# Altium schematic sheet 0_SurvBot_RCU_Overview.SchDoc
size A4; SheetNumber: 1; SheetTotal: 8
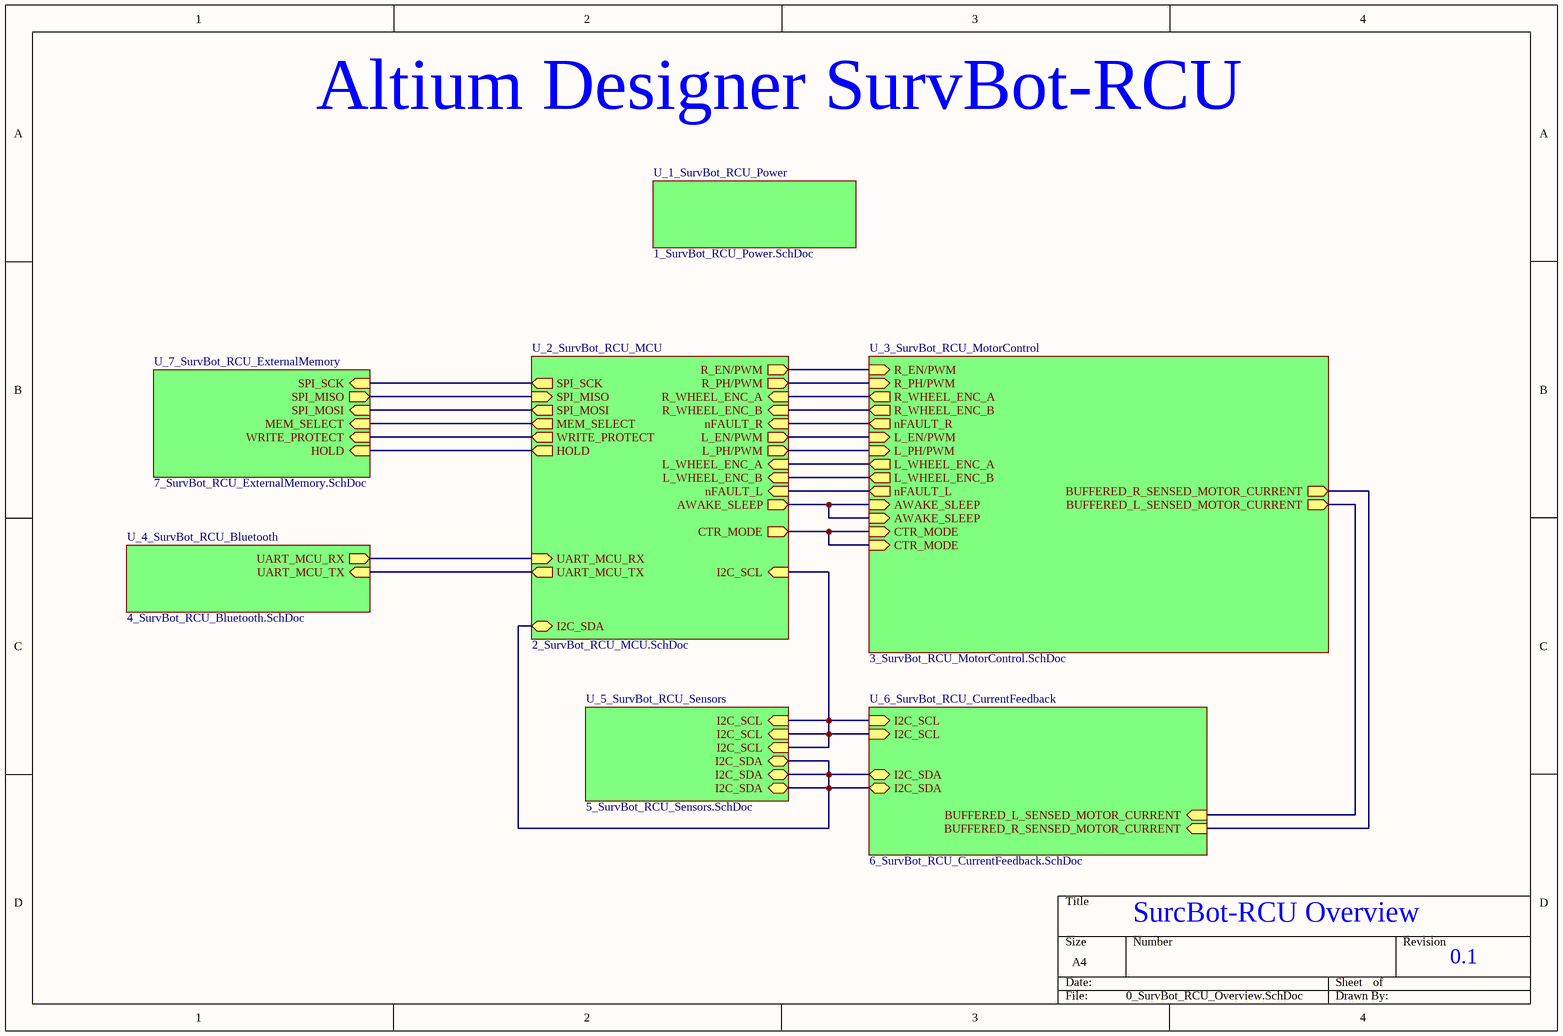
[diagram p0: 0_SurvBot_RCU_Overview.SchDoc]

## Sub-sheets
U_1_SurvBot_RCU_Power = 1_SurvBot_RCU_Power.SchDoc: no entries
U_2_SurvBot_RCU_MCU = 2_SurvBot_RCU_MCU.SchDoc: R_PH/PWM (out), R_EN/PWM (out), L_WHEEL_ENC_A (in), L_WHEEL_ENC_B (in), L_PH/PWM (out), L_EN/PWM (out), MEM_SELECT (out), SPI_MOSI (out), SPI_MISO (in), SPI_SCK (out), WRITE_PROTECT (out), HOLD (out), nFAULT_L (in), nFAULT_R (in), UART_MCU_TX (out), UART_MCU_RX (in), CTR_MODE (out), AWAKE_SLEEP (out), R_WHEEL_ENC_A (in), R_WHEEL_ENC_B (in), I2C_SDA (bidir), I2C_SCL (in)
U_3_SurvBot_RCU_MotorControl = 3_SurvBot_RCU_MotorControl.SchDoc: R_EN/PWM (in), R_PH/PWM (in), CTR_MODE (in), nFAULT_R (out), BUFFERED_R_SENSED_MOTOR_CURRENT (out), BUFFERED_L_SENSED_MOTOR_CURRENT (out), R_WHEEL_ENC_A (out), R_WHEEL_ENC_B (out), L_WHEEL_ENC_A (out), L_WHEEL_ENC_B (out), AWAKE_SLEEP (in), L_EN/PWM (in), L_PH/PWM (in), nFAULT_L (out), AWAKE_SLEEP (in), CTR_MODE (in)
U_4_SurvBot_RCU_Bluetooth = 4_SurvBot_RCU_Bluetooth.SchDoc: UART_MCU_TX (in), UART_MCU_RX (out)
U_5_SurvBot_RCU_Sensors = 5_SurvBot_RCU_Sensors.SchDoc: I2C_SDA (bidir), I2C_SCL (in), I2C_SDA (bidir), I2C_SCL (in), I2C_SDA (bidir), I2C_SCL (in)
U_6_SurvBot_RCU_CurrentFeedback = 6_SurvBot_RCU_CurrentFeedback.SchDoc: I2C_SCL (in), I2C_SDA (bidir), BUFFERED_R_SENSED_MOTOR_CURRENT (in), I2C_SCL (in), I2C_SDA (bidir), BUFFERED_L_SENSED_MOTOR_CURRENT (in)
U_7_SurvBot_RCU_ExternalMemory = 7_SurvBot_RCU_ExternalMemory.SchDoc: MEM_SELECT (in), SPI_MOSI (in), SPI_MISO (out), SPI_SCK (in), WRITE_PROTECT (in), HOLD (in)

## Nets
(unnamed): sheet U_2_SurvBot_RCU_MCU/R_PH/PWM, sheet U_3_SurvBot_RCU_MotorControl/R_PH/PWM
(unnamed): sheet U_2_SurvBot_RCU_MCU/R_EN/PWM, sheet U_3_SurvBot_RCU_MotorControl/R_EN/PWM
(unnamed): sheet U_2_SurvBot_RCU_MCU/L_WHEEL_ENC_A, sheet U_3_SurvBot_RCU_MotorControl/L_WHEEL_ENC_A
(unnamed): sheet U_2_SurvBot_RCU_MCU/L_WHEEL_ENC_B, sheet U_3_SurvBot_RCU_MotorControl/L_WHEEL_ENC_B
(unnamed): sheet U_2_SurvBot_RCU_MCU/L_PH/PWM, sheet U_3_SurvBot_RCU_MotorControl/L_PH/PWM
(unnamed): sheet U_2_SurvBot_RCU_MCU/L_EN/PWM, sheet U_3_SurvBot_RCU_MotorControl/L_EN/PWM
(unnamed): sheet U_2_SurvBot_RCU_MCU/MEM_SELECT, sheet U_7_SurvBot_RCU_ExternalMemory/MEM_SELECT
(unnamed): sheet U_2_SurvBot_RCU_MCU/SPI_MOSI, sheet U_7_SurvBot_RCU_ExternalMemory/SPI_MOSI
(unnamed): sheet U_2_SurvBot_RCU_MCU/SPI_MISO, sheet U_7_SurvBot_RCU_ExternalMemory/SPI_MISO
(unnamed): sheet U_2_SurvBot_RCU_MCU/SPI_SCK, sheet U_7_SurvBot_RCU_ExternalMemory/SPI_SCK
(unnamed): sheet U_2_SurvBot_RCU_MCU/WRITE_PROTECT, sheet U_7_SurvBot_RCU_ExternalMemory/WRITE_PROTECT
(unnamed): sheet U_2_SurvBot_RCU_MCU/HOLD, sheet U_7_SurvBot_RCU_ExternalMemory/HOLD
(unnamed): sheet U_2_SurvBot_RCU_MCU/nFAULT_L, sheet U_3_SurvBot_RCU_MotorControl/nFAULT_L
(unnamed): sheet U_2_SurvBot_RCU_MCU/nFAULT_R, sheet U_3_SurvBot_RCU_MotorControl/nFAULT_R
(unnamed): sheet U_2_SurvBot_RCU_MCU/UART_MCU_TX, sheet U_4_SurvBot_RCU_Bluetooth/UART_MCU_TX
(unnamed): sheet U_2_SurvBot_RCU_MCU/UART_MCU_RX, sheet U_4_SurvBot_RCU_Bluetooth/UART_MCU_RX
(unnamed): sheet U_2_SurvBot_RCU_MCU/CTR_MODE, sheet U_3_SurvBot_RCU_MotorControl/CTR_MODE, sheet U_3_SurvBot_RCU_MotorControl/CTR_MODE
(unnamed): sheet U_2_SurvBot_RCU_MCU/AWAKE_SLEEP, sheet U_3_SurvBot_RCU_MotorControl/AWAKE_SLEEP, sheet U_3_SurvBot_RCU_MotorControl/AWAKE_SLEEP
(unnamed): sheet U_2_SurvBot_RCU_MCU/R_WHEEL_ENC_A, sheet U_3_SurvBot_RCU_MotorControl/R_WHEEL_ENC_A
(unnamed): sheet U_2_SurvBot_RCU_MCU/R_WHEEL_ENC_B, sheet U_3_SurvBot_RCU_MotorControl/R_WHEEL_ENC_B
(unnamed): sheet U_2_SurvBot_RCU_MCU/I2C_SDA, sheet U_6_SurvBot_RCU_CurrentFeedback/I2C_SDA, sheet U_6_SurvBot_RCU_CurrentFeedback/I2C_SDA, sheet U_5_SurvBot_RCU_Sensors/I2C_SDA, sheet U_5_SurvBot_RCU_Sensors/I2C_SDA, sheet U_5_SurvBot_RCU_Sensors/I2C_SDA
(unnamed): sheet U_2_SurvBot_RCU_MCU/I2C_SCL, sheet U_6_SurvBot_RCU_CurrentFeedback/I2C_SCL, sheet U_6_SurvBot_RCU_CurrentFeedback/I2C_SCL, sheet U_5_SurvBot_RCU_Sensors/I2C_SCL, sheet U_5_SurvBot_RCU_Sensors/I2C_SCL, sheet U_5_SurvBot_RCU_Sensors/I2C_SCL
(unnamed): sheet U_3_SurvBot_RCU_MotorControl/BUFFERED_R_SENSED_MOTOR_CURRENT, sheet U_6_SurvBot_RCU_CurrentFeedback/BUFFERED_R_SENSED_MOTOR_CURRENT
(unnamed): sheet U_3_SurvBot_RCU_MotorControl/BUFFERED_L_SENSED_MOTOR_CURRENT, sheet U_6_SurvBot_RCU_CurrentFeedback/BUFFERED_L_SENSED_MOTOR_CURRENT

## Notes on the sheet
- Altium Designer SurvBot-RCU
- SurcBot-RCU Overview
- 0.1